# EAGLE design rgb-daughter (EAGLE 8.3.2)

## Sheet 1 of 2
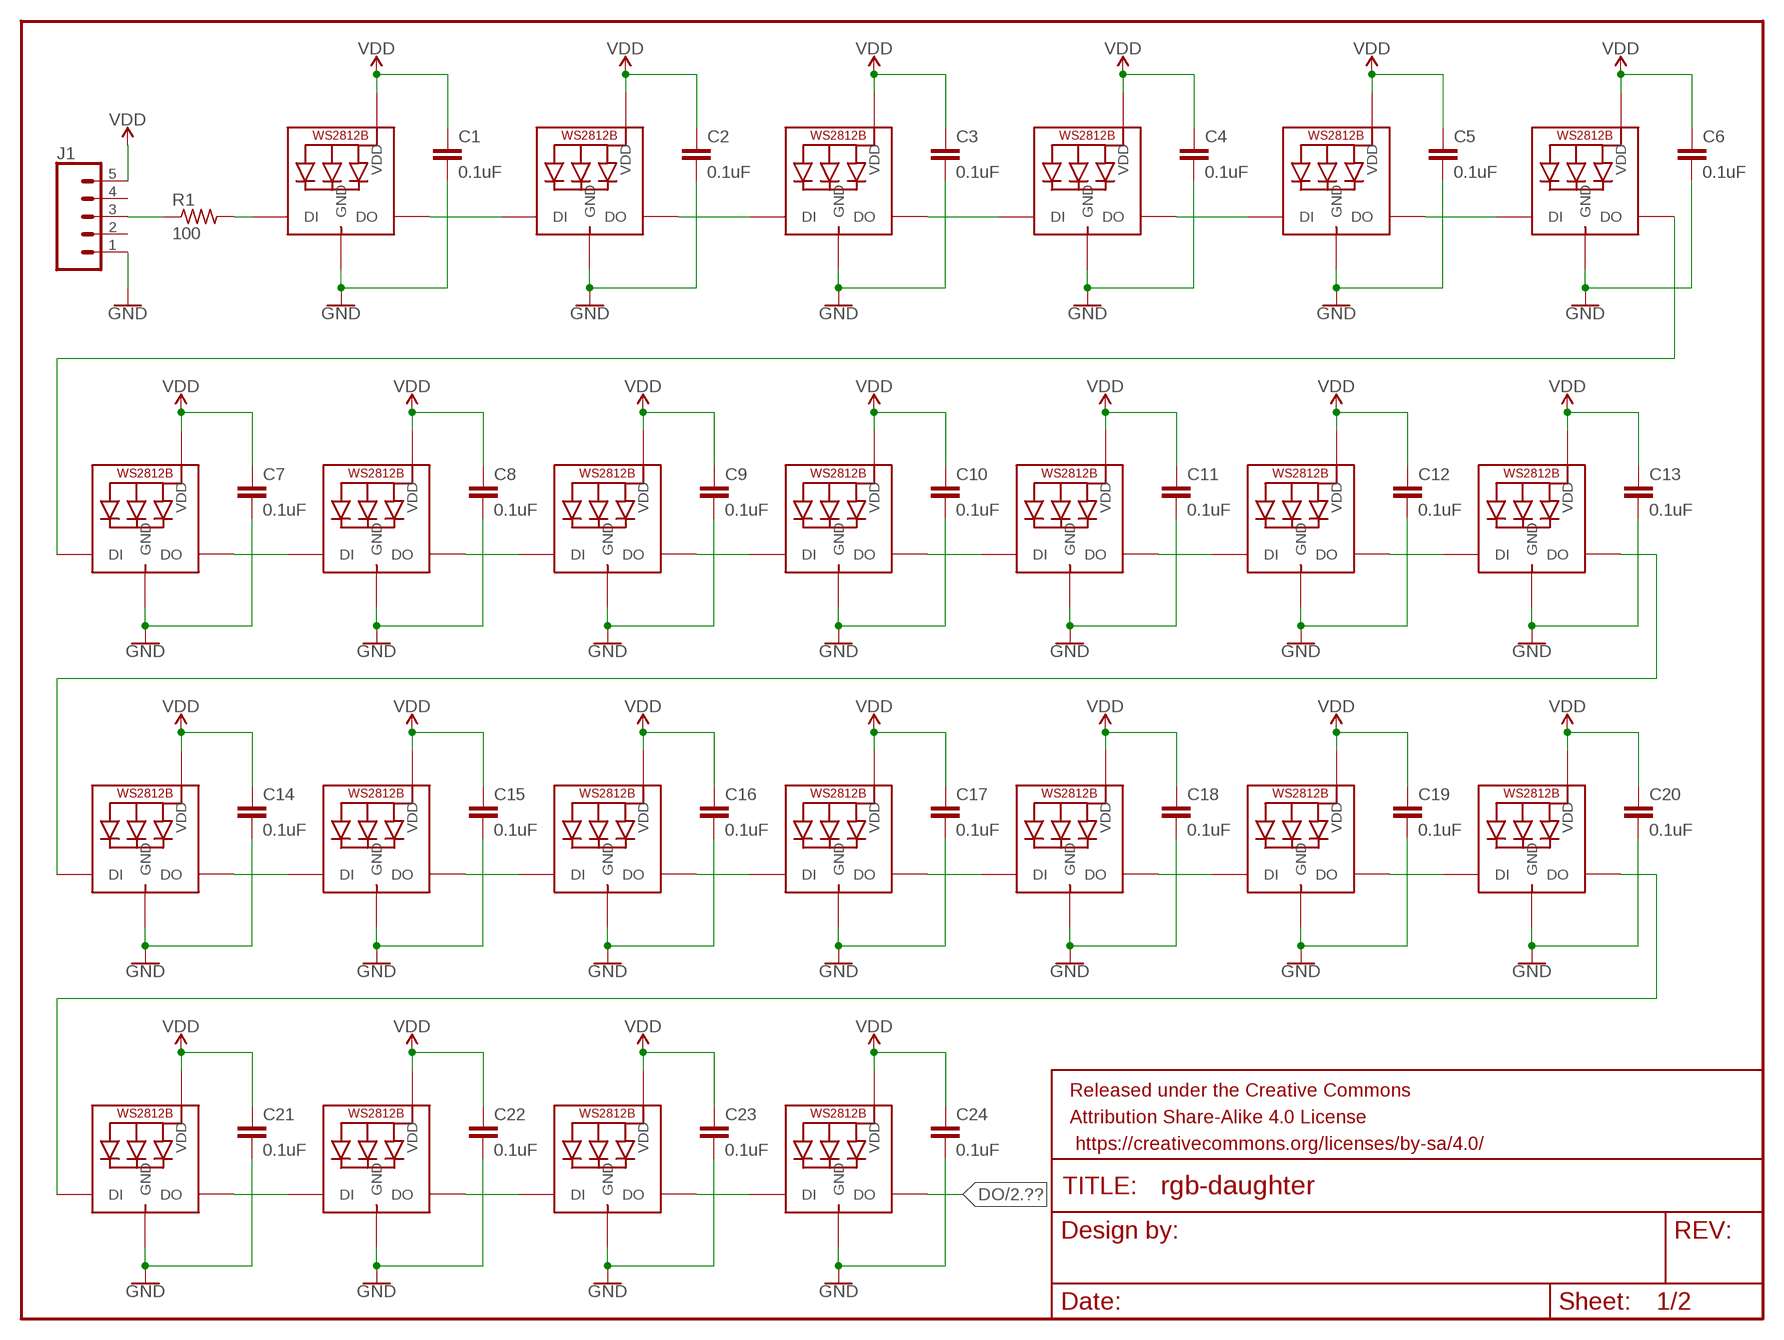
[diagram p0: schematic, sheet 1]

### Parts
C1  0.1uF  0.1UF-0603-25V-(+80/-20%)  [0603]
C2  0.1uF  0.1UF-0603-25V-(+80/-20%)  [0603]
C3  0.1uF  0.1UF-0603-25V-(+80/-20%)  [0603]
C4  0.1uF  0.1UF-0603-25V-(+80/-20%)  [0603]
C5  0.1uF  0.1UF-0603-25V-(+80/-20%)  [0603]
C6  0.1uF  0.1UF-0603-25V-(+80/-20%)  [0603]
C7  0.1uF  0.1UF-0603-25V-(+80/-20%)  [0603]
C8  0.1uF  0.1UF-0603-25V-(+80/-20%)  [0603]
C9  0.1uF  0.1UF-0603-25V-(+80/-20%)  [0603]
C10  0.1uF  0.1UF-0603-25V-(+80/-20%)  [0603]
C11  0.1uF  0.1UF-0603-25V-(+80/-20%)  [0603]
C12  0.1uF  0.1UF-0603-25V-(+80/-20%)  [0603]
C13  0.1uF  0.1UF-0603-25V-(+80/-20%)  [0603]
C14  0.1uF  0.1UF-0603-25V-(+80/-20%)  [0603]
C15  0.1uF  0.1UF-0603-25V-(+80/-20%)  [0603]
C16  0.1uF  0.1UF-0603-25V-(+80/-20%)  [0603]
C17  0.1uF  0.1UF-0603-25V-(+80/-20%)  [0603]
C18  0.1uF  0.1UF-0603-25V-(+80/-20%)  [0603]
C19  0.1uF  0.1UF-0603-25V-(+80/-20%)  [0603]
C20  0.1uF  0.1UF-0603-25V-(+80/-20%)  [0603]
C21  0.1uF  0.1UF-0603-25V-(+80/-20%)  [0603]
C22  0.1uF  0.1UF-0603-25V-(+80/-20%)  [0603]
C23  0.1uF  0.1UF-0603-25V-(+80/-20%)  [0603]
C24  0.1uF  0.1UF-0603-25V-(+80/-20%)  [0603]
FRAME1  FRAME-LETTER  [CREATIVE_COMMONS]
J1  CONN_051.27MM  [1X05_1.27MM]
LED1  WS2812B3535  [LED3535]
LED2  WS2812B3535  [LED3535]
LED3  WS2812B3535  [LED3535]
LED4  WS2812B3535  [LED3535]
LED5  WS2812B3535  [LED3535]
LED6  WS2812B3535  [LED3535]
LED7  WS2812B3535  [LED3535]
LED8  WS2812B3535  [LED3535]
LED9  WS2812B3535  [LED3535]
LED10  WS2812B3535  [LED3535]
LED11  WS2812B3535  [LED3535]
LED12  WS2812B3535  [LED3535]
LED13  WS2812B3535  [LED3535]
LED14  WS2812B3535  [LED3535]
LED15  WS2812B3535  [LED3535]
LED16  WS2812B3535  [LED3535]
LED17  WS2812B3535  [LED3535]
LED18  WS2812B3535  [LED3535]
LED19  WS2812B3535  [LED3535]
LED20  WS2812B3535  [LED3535]
LED21  WS2812B3535  [LED3535]
LED22  WS2812B3535  [LED3535]
LED23  WS2812B3535  [LED3535]
LED48  WS2812B3535  [LED3535]
R1  100  R-US_M0805  [M0805]

### Nets
DO: LED48.3(DO) ; also sheet 2
GND: C1.2 C2.2 C3.2 C4.2 C5.2 C6.2 C7.2 C8.2 C9.2 C10.2 C11.2 C12.2 C13.2 C14.2 C15.2 C16.2 C17.2 C18.2 C19.2 C20.2 C21.2 C22.2 C23.2 C24.2 J1.1 LED1.4(GND) LED2.4(GND) LED3.4(GND) LED4.4(GND) LED5.4(GND) LED6.4(GND) LED7.4(GND) LED8.4(GND) LED9.4(GND) LED10.4(GND) LED11.4(GND) LED12.4(GND) LED13.4(GND) LED14.4(GND) LED15.4(GND) LED16.4(GND) LED17.4(GND) LED18.4(GND) LED19.4(GND) LED20.4(GND) LED21.4(GND) LED22.4(GND) LED23.4(GND) LED48.4(GND) ; also sheet 2
N$1: LED1.1(DI) R1.2
N$2: LED1.3(DO) LED2.1(DI)
N$3: J1.3 R1.1
N$4: LED2.3(DO) LED3.1(DI)
N$5: LED3.3(DO) LED4.1(DI)
N$6: LED4.3(DO) LED5.1(DI)
N$7: LED5.3(DO) LED6.1(DI)
N$8: LED7.3(DO) LED8.1(DI)
N$9: LED8.3(DO) LED9.1(DI)
N$10: LED9.3(DO) LED10.1(DI)
N$11: LED10.3(DO) LED11.1(DI)
N$12: LED11.3(DO) LED12.1(DI)
N$13: LED12.3(DO) LED13.1(DI)
N$14: LED13.3(DO) LED14.1(DI)
N$15: LED14.3(DO) LED15.1(DI)
N$16: LED15.3(DO) LED16.1(DI)
N$17: LED16.3(DO) LED17.1(DI)
N$18: LED17.3(DO) LED18.1(DI)
N$19: LED18.3(DO) LED19.1(DI)
N$20: LED19.3(DO) LED20.1(DI)
N$21: LED20.3(DO) LED21.1(DI)
N$23: LED21.3(DO) LED22.1(DI)
N$24: LED22.3(DO) LED23.1(DI)
N$25: LED23.3(DO) LED48.1(DI)
N$48: LED6.3(DO) LED7.1(DI)
VDD: C1.1 C2.1 C3.1 C4.1 C5.1 C6.1 C7.1 C8.1 C9.1 C10.1 C11.1 C12.1 C13.1 C14.1 C15.1 C16.1 C17.1 C18.1 C19.1 C20.1 C21.1 C22.1 C23.1 C24.1 J1.5 LED1.2(VDD) LED2.2(VDD) LED3.2(VDD) LED4.2(VDD) LED5.2(VDD) LED6.2(VDD) LED7.2(VDD) LED8.2(VDD) LED9.2(VDD) LED10.2(VDD) LED11.2(VDD) LED12.2(VDD) LED13.2(VDD) LED14.2(VDD) LED15.2(VDD) LED16.2(VDD) LED17.2(VDD) LED18.2(VDD) LED19.2(VDD) LED20.2(VDD) LED21.2(VDD) LED22.2(VDD) LED23.2(VDD) LED48.2(VDD) ; also sheet 2
Unconnected: J1.2 J1.4

## Sheet 2 of 2
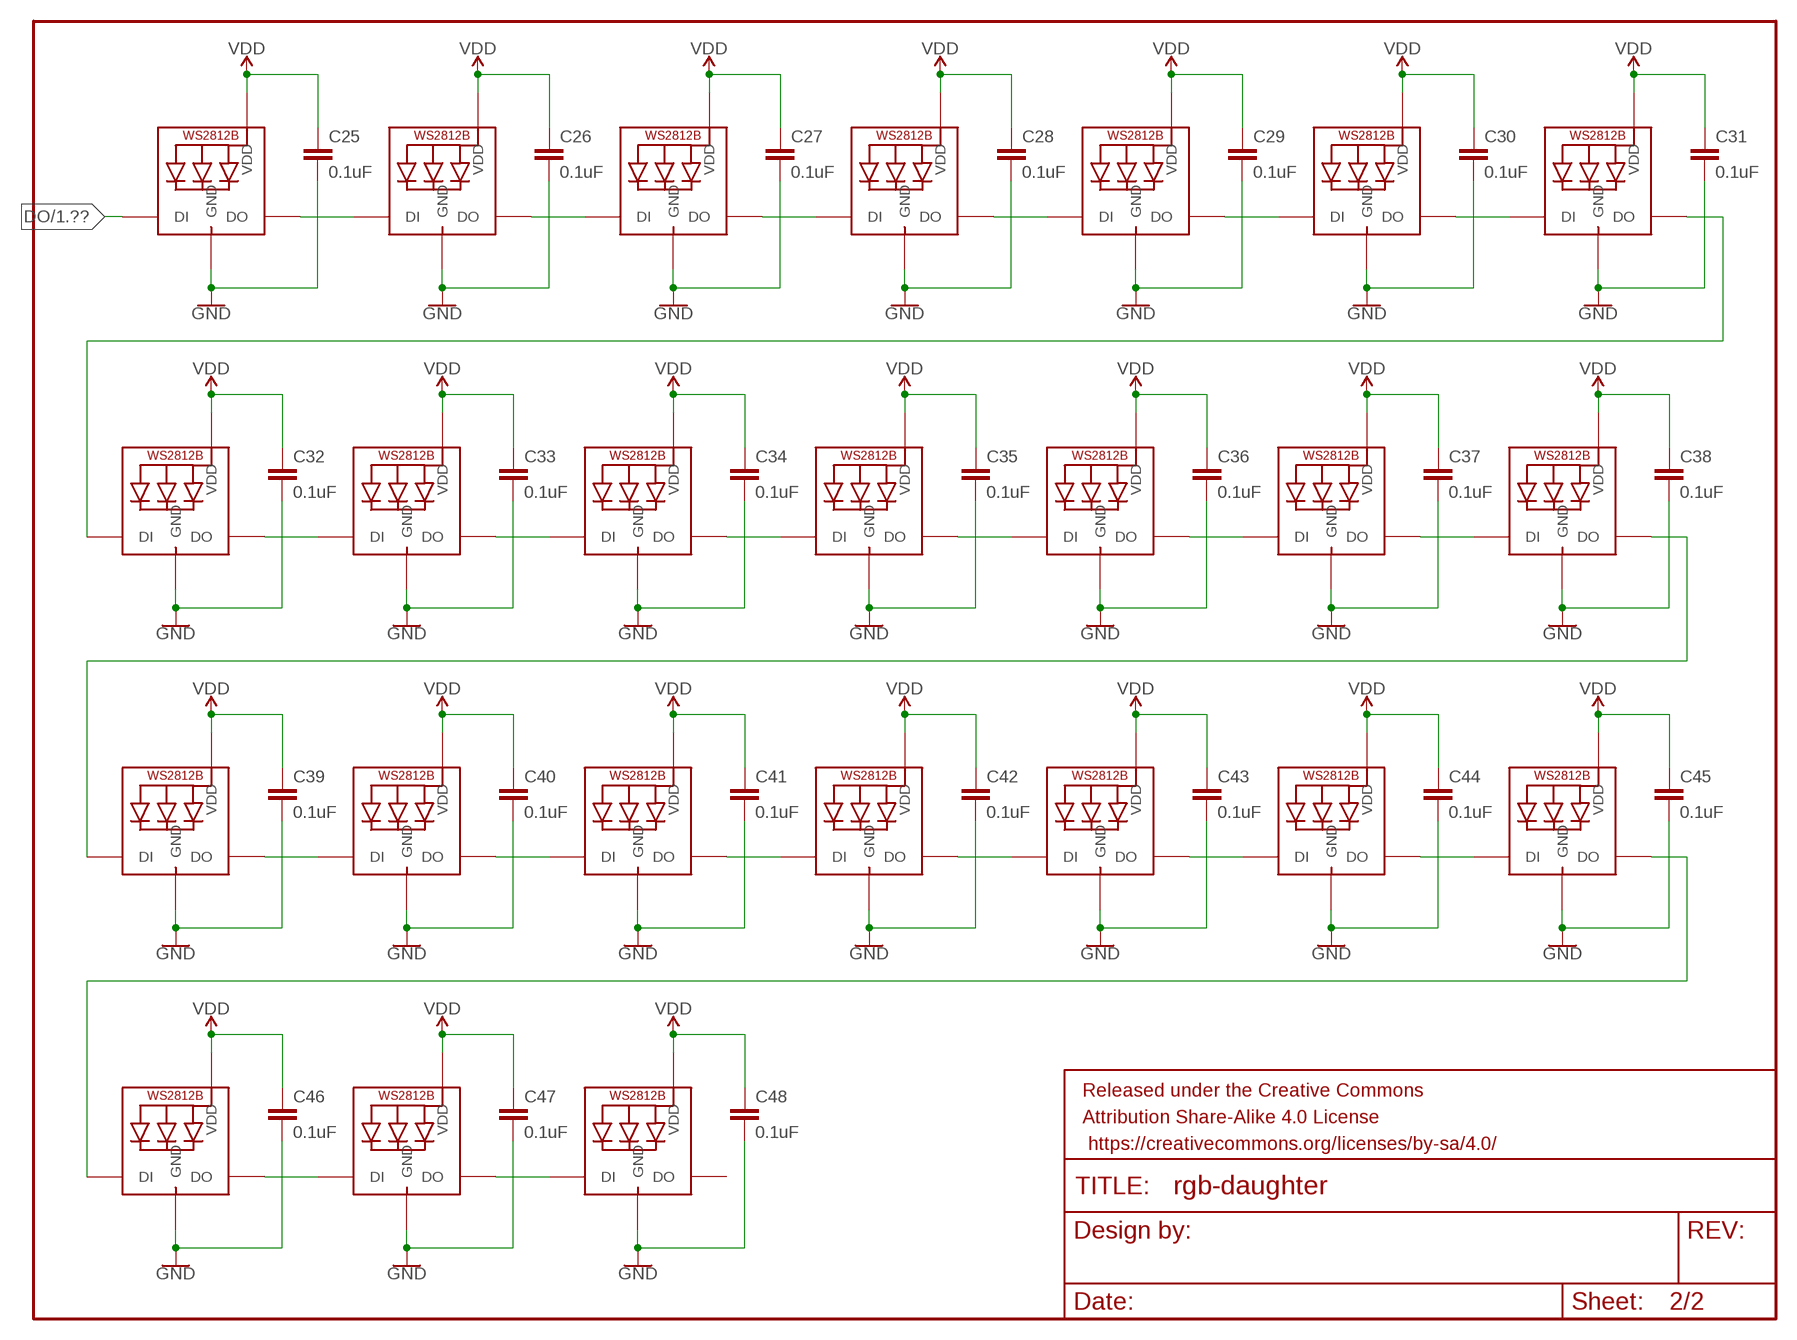
[diagram p1: schematic, sheet 2]

### Parts
C25  0.1uF  0.1UF-0603-25V-(+80/-20%)  [0603]
C26  0.1uF  0.1UF-0603-25V-(+80/-20%)  [0603]
C27  0.1uF  0.1UF-0603-25V-(+80/-20%)  [0603]
C28  0.1uF  0.1UF-0603-25V-(+80/-20%)  [0603]
C29  0.1uF  0.1UF-0603-25V-(+80/-20%)  [0603]
C30  0.1uF  0.1UF-0603-25V-(+80/-20%)  [0603]
C31  0.1uF  0.1UF-0603-25V-(+80/-20%)  [0603]
C32  0.1uF  0.1UF-0603-25V-(+80/-20%)  [0603]
C33  0.1uF  0.1UF-0603-25V-(+80/-20%)  [0603]
C34  0.1uF  0.1UF-0603-25V-(+80/-20%)  [0603]
C35  0.1uF  0.1UF-0603-25V-(+80/-20%)  [0603]
C36  0.1uF  0.1UF-0603-25V-(+80/-20%)  [0603]
C37  0.1uF  0.1UF-0603-25V-(+80/-20%)  [0603]
C38  0.1uF  0.1UF-0603-25V-(+80/-20%)  [0603]
C39  0.1uF  0.1UF-0603-25V-(+80/-20%)  [0603]
C40  0.1uF  0.1UF-0603-25V-(+80/-20%)  [0603]
C41  0.1uF  0.1UF-0603-25V-(+80/-20%)  [0603]
C42  0.1uF  0.1UF-0603-25V-(+80/-20%)  [0603]
C43  0.1uF  0.1UF-0603-25V-(+80/-20%)  [0603]
C44  0.1uF  0.1UF-0603-25V-(+80/-20%)  [0603]
C45  0.1uF  0.1UF-0603-25V-(+80/-20%)  [0603]
C46  0.1uF  0.1UF-0603-25V-(+80/-20%)  [0603]
C47  0.1uF  0.1UF-0603-25V-(+80/-20%)  [0603]
C48  0.1uF  0.1UF-0603-25V-(+80/-20%)  [0603]
FRAME2  FRAME-LETTER  [CREATIVE_COMMONS]
LED24  WS2812B3535  [LED3535]
LED25  WS2812B3535  [LED3535]
LED26  WS2812B3535  [LED3535]
LED27  WS2812B3535  [LED3535]
LED28  WS2812B3535  [LED3535]
LED29  WS2812B3535  [LED3535]
LED30  WS2812B3535  [LED3535]
LED31  WS2812B3535  [LED3535]
LED32  WS2812B3535  [LED3535]
LED33  WS2812B3535  [LED3535]
LED34  WS2812B3535  [LED3535]
LED35  WS2812B3535  [LED3535]
LED36  WS2812B3535  [LED3535]
LED37  WS2812B3535  [LED3535]
LED38  WS2812B3535  [LED3535]
LED39  WS2812B3535  [LED3535]
LED40  WS2812B3535  [LED3535]
LED41  WS2812B3535  [LED3535]
LED42  WS2812B3535  [LED3535]
LED43  WS2812B3535  [LED3535]
LED44  WS2812B3535  [LED3535]
LED45  WS2812B3535  [LED3535]
LED46  WS2812B3535  [LED3535]
LED47  WS2812B3535  [LED3535]

### Nets
DO: LED24.1(DI) ; also sheet 1
GND: C25.2 C26.2 C27.2 C28.2 C29.2 C30.2 C31.2 C32.2 C33.2 C34.2 C35.2 C36.2 C37.2 C38.2 C39.2 C40.2 C41.2 C42.2 C43.2 C44.2 C45.2 C46.2 C47.2 C48.2 LED24.4(GND) LED25.4(GND) LED26.4(GND) LED27.4(GND) LED28.4(GND) LED29.4(GND) LED30.4(GND) LED31.4(GND) LED32.4(GND) LED33.4(GND) LED34.4(GND) LED35.4(GND) LED36.4(GND) LED37.4(GND) LED38.4(GND) LED39.4(GND) LED40.4(GND) LED41.4(GND) LED42.4(GND) LED43.4(GND) LED44.4(GND) LED45.4(GND) LED46.4(GND) LED47.4(GND) ; also sheet 1
N$22: LED24.3(DO) LED25.1(DI)
N$26: LED25.3(DO) LED26.1(DI)
N$27: LED26.3(DO) LED27.1(DI)
N$28: LED27.3(DO) LED28.1(DI)
N$29: LED28.3(DO) LED29.1(DI)
N$30: LED29.3(DO) LED30.1(DI)
N$31: LED30.3(DO) LED31.1(DI)
N$32: LED31.3(DO) LED32.1(DI)
N$33: LED32.3(DO) LED33.1(DI)
N$34: LED33.3(DO) LED34.1(DI)
N$35: LED34.3(DO) LED35.1(DI)
N$36: LED35.3(DO) LED36.1(DI)
N$37: LED36.3(DO) LED37.1(DI)
N$38: LED37.3(DO) LED38.1(DI)
N$39: LED38.3(DO) LED39.1(DI)
N$40: LED39.3(DO) LED40.1(DI)
N$41: LED40.3(DO) LED41.1(DI)
N$42: LED41.3(DO) LED42.1(DI)
N$43: LED42.3(DO) LED43.1(DI)
N$44: LED43.3(DO) LED44.1(DI)
N$45: LED44.3(DO) LED45.1(DI)
N$46: LED45.3(DO) LED46.1(DI)
N$47: LED46.3(DO) LED47.1(DI)
VDD: C25.1 C26.1 C27.1 C28.1 C29.1 C30.1 C31.1 C32.1 C33.1 C34.1 C35.1 C36.1 C37.1 C38.1 C39.1 C40.1 C41.1 C42.1 C43.1 C44.1 C45.1 C46.1 C47.1 C48.1 LED24.2(VDD) LED25.2(VDD) LED26.2(VDD) LED27.2(VDD) LED28.2(VDD) LED29.2(VDD) LED30.2(VDD) LED31.2(VDD) LED32.2(VDD) LED33.2(VDD) LED34.2(VDD) LED35.2(VDD) LED36.2(VDD) LED37.2(VDD) LED38.2(VDD) LED39.2(VDD) LED40.2(VDD) LED41.2(VDD) LED42.2(VDD) LED43.2(VDD) LED44.2(VDD) LED45.2(VDD) LED46.2(VDD) LED47.2(VDD) ; also sheet 1
Unconnected: LED47.3(DO)

## Library data of the parts
C1-C48 = SparkFun-Capacitors:0.1UF: 0.1µF ceramic capacitors A capacitor is a passive two-terminal electrical component used to store electrical energy temporarily in an electric field.; PROD_ID: CAP-00810
FRAME1 FRAME2 = SparkFun-Aesthetics:FRAME-LETTER: Schematic Frame - Letter Standard 8.5x11 US Letter frame
J1 = SparkFun-Connectors:CONN_05: Multi connection point. Often used as Generic Header-pin footprint for 0.1 inch spaced/style header connections On any of the 0.1 inch spaced packages, you can populate with these: Break Away Headers - Straight <https://www.sparkfun.com/products/116> (PRT-00116) Break Away Male Headers - Right Angle <https://www.sparkfun.com/products/553> (PRT-00553) Female Headers <https://www.sparkfun.com/products/115> (PRT-00115) Break Away Headers - Machine Pin <https://www.sparkfun.com/products/117> (PRT-00117) Break Away Female Headers - Swiss Machine Pin <https://www.sparkfun.com/products/743> (PRT-00743) For SCREWTERMINALS and SPRING TERMINALS visit here: Screw Terimnals on SparkFun.com <https://www.sparkfun.com/search/results?term=Screw+Terminals> (5mm/3.5mm/2.54mm spacing) This device is also useful as a general connection point to wire up your design to another part of your project. Our various solder wires solder well into these plated through hole pads. Hook-Up Wire - Assortment (Stranded, 22 AWG) <https://www.sparkfun.com/products/11375> (PRT-11375) Hook-Up Wire - Assortment (Solid Core, 22 AWG) <https://www.sparkfun.com/products/11367> (PRT-11367) View the entire wire category on our website here <https://www.sparkfun.com/categories/141> Special notes: Molex polarized connector foot print use with SKU : PRT-08231 with associated crimp pins and housings. 1MM SMD Version SKU: PRT-10208
LED1-LED48 = adafruit:WS2812B
R1 = resistor:R-US_: RESISTOR, American symbol

## Board
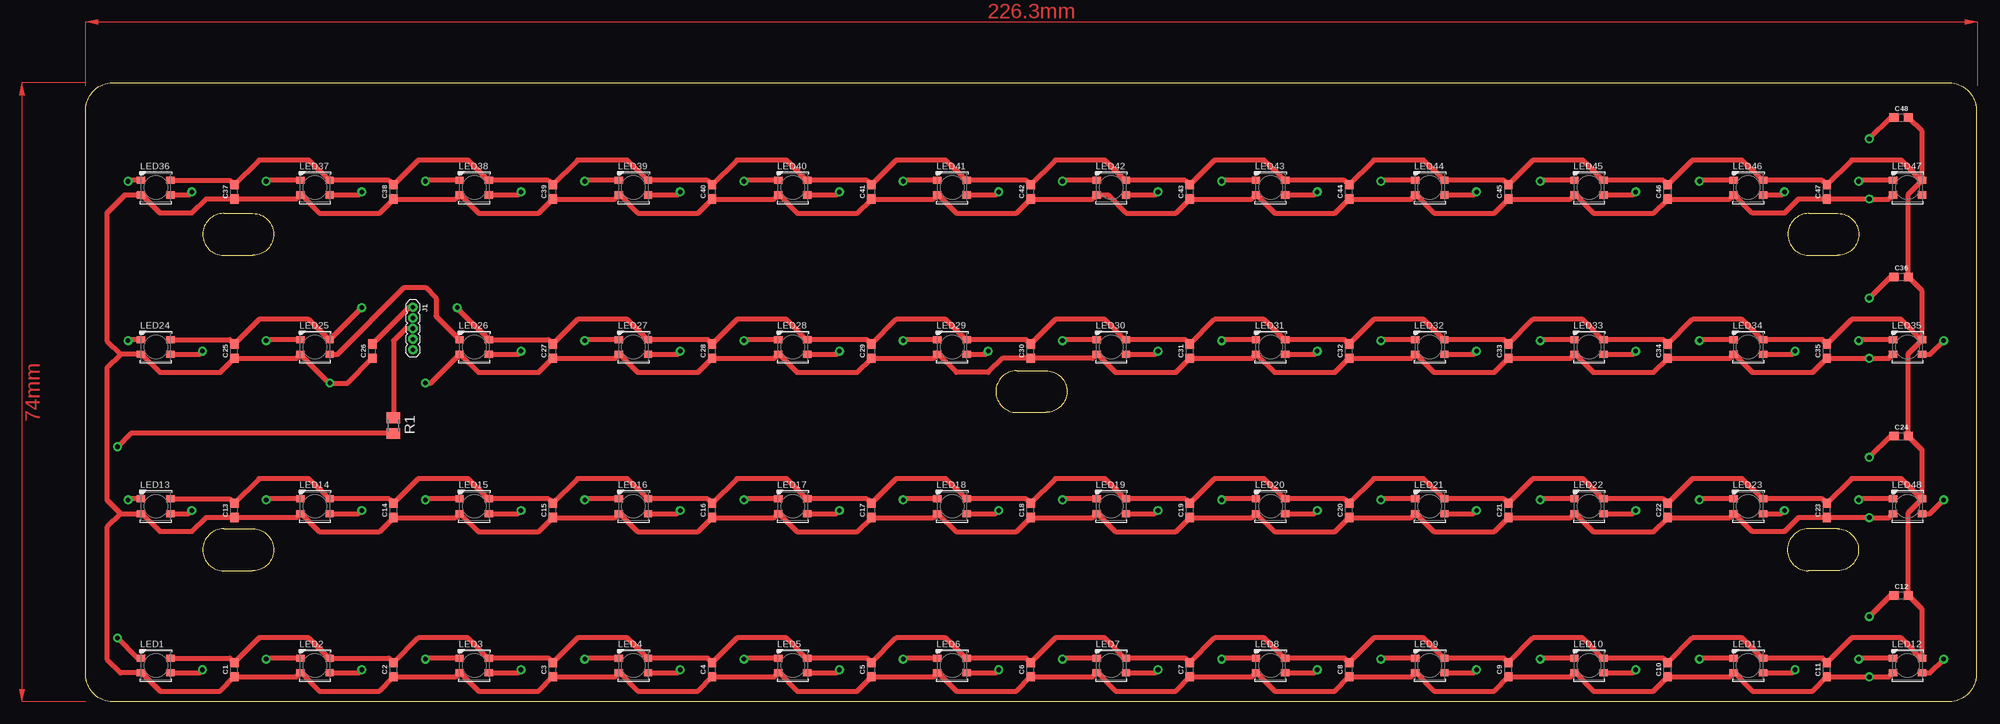
[diagram p2: board, top side]
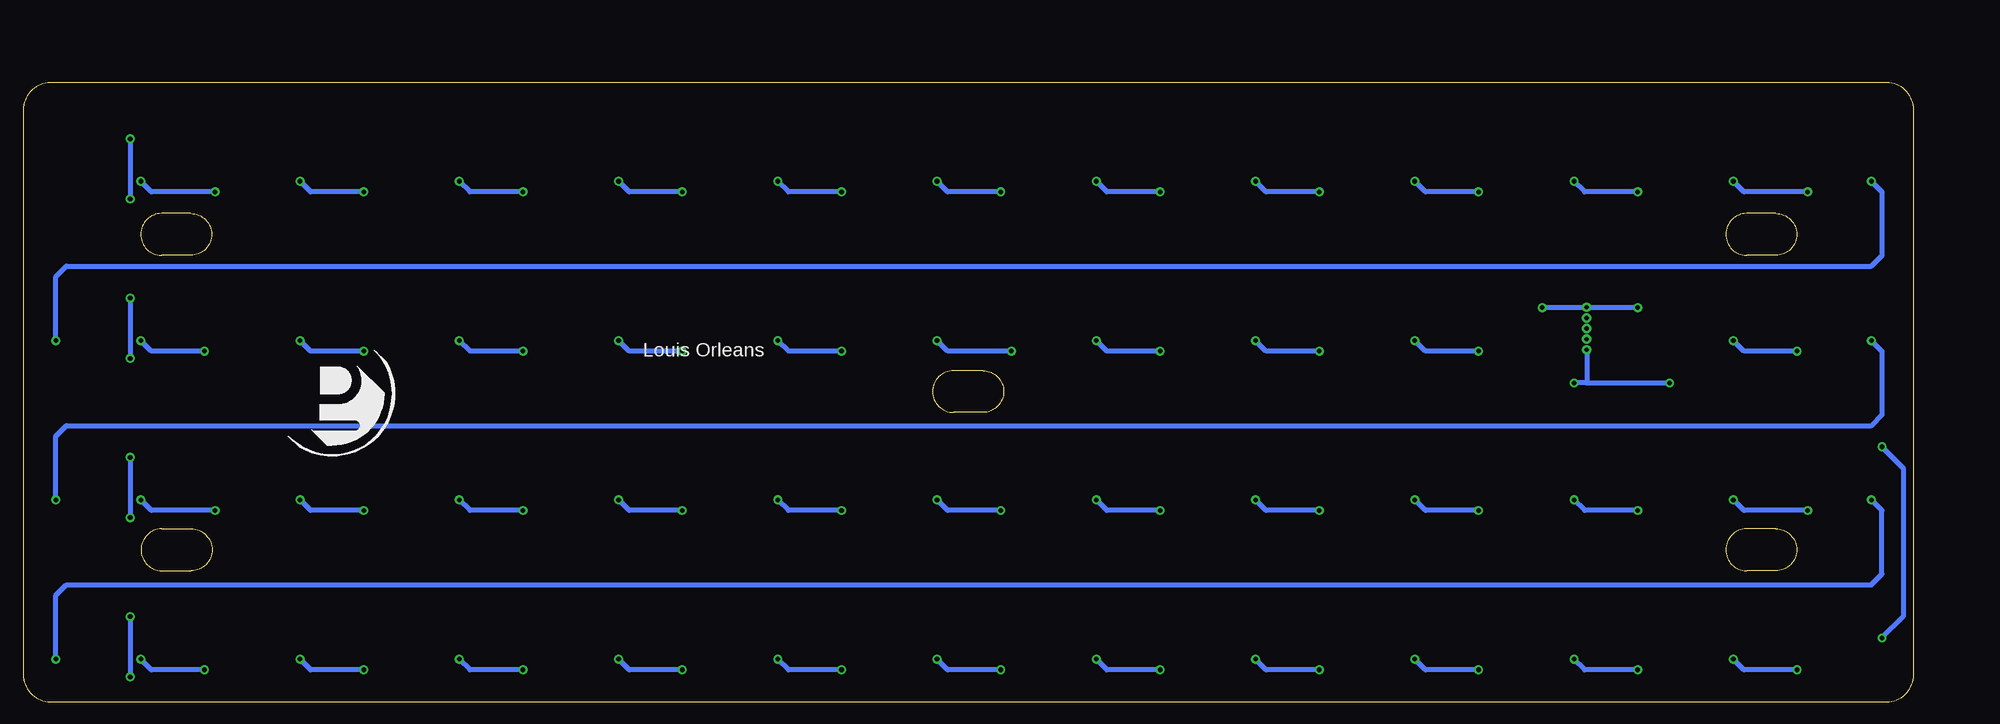
[diagram p3: board, bottom side, seen from below]

Size 226.14 x 74 mm. Coordinates in mm from the lower left corner, seen from the top.
Outline: 222.91,0 3.23,0 arc-90 0,3.23 0,70.78 arc-90 3.23,74 222.91,74 arc-90 226.14,70.78 226.14,3.23 arc-90 222.91,0
Outline: 16.5,58.38 arc180 16.5,53.38 20,53.38 arc180 20,58.38 16.5,58.38
Outline: 16.5,20.66 arc180 16.5,15.66 20,15.66 arc180 20,20.66 16.5,20.66
Outline: 209.56,20.66 arc-180 209.56,15.66 206.06,15.66 arc-180 206.06,20.66 209.56,20.66
Outline: 206.11,58.38 arc180 206.11,53.38 209.61,53.38 arc180 209.61,58.38 206.11,58.38
Outline: 111.37,39.58 arc180 111.37,34.58 114.87,34.58 arc180 114.87,39.58 111.37,39.58
Copper layers (1*16): Top 0.035mm / dielectric 1.5mm / Bottom 0.035mm
Design rules "SparkFun": minimum track width 8mil, minimum drill 20mil, track to track 8mil, track to pad 8mil, pad to pad 8mil, via to via 8mil, smd to smd 8mil, copper to edge 8mil, drill to drill 8mil, minimum pad ring 12mil, minimum via ring 10mil, stop-mask expansion 4mil, vias tented up to drill 20mil, thermal gap 10mil

### Footprints (pad centres in the part's own frame; a part is rotated, then mirrored left to right if it is on the bottom)
0603 = smd 1.1 x 1: 1 -0.85,0; 2 0.85,0
1X05_1.27MM = drill 0.508 pad 1: 1 0,0; 2 1.27,0; 3 2.54,0; 4 3.81,0; 5 5.08,0
LED3535 = smd 1 x 0.85: 1 -1.75,0.875; 2 -1.75,-0.875; 3 1.75,-0.875; 4 1.75,0.875
M0805 = smd 1.3 x 1.6: 1 -0.95,0; 2 0.95,0

### Placement (x,y rotation side)
C1  17.78,3.81 90 top
C2  36.83,3.81 90 top
C3  55.88,3.81 90 top
C4  74.93,3.81 90 top
C5  93.98,3.81 90 top
C6  113.03,3.81 90 top
C7  132.08,3.81 90 top
C8  151.13,3.81 90 top
C9  170.18,3.81 90 top
C10  189.23,3.81 90 top
C11  208.28,3.81 90 top
C12  217.17,12.7 0 top
C13  17.78,22.86 90 top
C14  36.83,22.86 90 top
C15  55.88,22.86 90 top
C16  74.93,22.86 90 top
C17  93.98,22.86 90 top
C18  113.03,22.86 90 top
C19  132.08,22.86 90 top
C20  151.13,22.86 90 top
C21  170.18,22.86 90 top
C22  189.23,22.86 90 top
C23  208.28,22.86 90 top
C24  217.17,31.75 0 top
C25  17.78,41.91 90 top
C26  34.29,41.91 90 top
C27  55.88,41.91 90 top
C28  74.93,41.91 90 top
C29  93.98,41.91 90 top
C30  113.03,41.91 90 top
C31  132.08,41.91 90 top
C32  151.13,41.91 90 top
C33  170.18,41.91 90 top
C34  189.23,41.91 90 top
C35  208.28,41.91 90 top
C36  217.17,50.8 0 top
C37  17.78,60.96 90 top
C38  36.83,60.96 90 top
C39  55.88,60.96 90 top
C40  74.93,60.96 90 top
C41  93.98,60.96 90 top
C42  113.03,60.96 90 top
C43  132.08,60.96 90 top
C44  151.13,60.96 90 top
C45  170.18,60.96 90 top
C46  189.23,60.96 90 top
C47  208.28,60.96 90 top
C48  217.17,69.85 0 top
FRAME1  178.69,41.27 0 bottom
FRAME2  157.48,-19.05 0 top  (outside the outline)
J1  39.14,47.16 270 top
LED1  8.38,4.32 0 top
LED2  27.43,4.32 0 top
LED3  46.48,4.32 0 top
LED4  65.53,4.32 0 top
LED5  84.58,4.32 0 top
LED6  103.63,4.32 0 top
LED7  122.68,4.32 0 top
LED8  141.73,4.32 0 top
LED9  160.78,4.32 0 top
LED10  179.83,4.32 0 top
LED11  198.88,4.32 0 top
LED12  217.93,4.32 0 top
LED13  8.38,23.37 0 top
LED14  27.43,23.37 0 top
LED15  46.48,23.37 0 top
LED16  65.53,23.37 0 top
LED17  84.58,23.37 0 top
LED18  103.63,23.37 0 top
LED19  122.68,23.37 0 top
LED20  141.73,23.37 0 top
LED21  160.78,23.37 0 top
LED22  179.83,23.37 0 top
LED23  198.88,23.37 0 top
LED24  8.38,42.42 0 top
LED25  27.43,42.42 0 top
LED26  46.48,42.42 0 top
LED27  65.53,42.42 0 top
LED28  84.58,42.42 0 top
LED29  103.63,42.42 0 top
LED30  122.68,42.42 0 top
LED31  141.73,42.42 0 top
LED32  160.78,42.42 0 top
LED33  179.83,42.42 0 top
LED34  198.88,42.42 0 top
LED35  217.93,42.42 0 top
LED36  8.38,61.47 0 top
LED37  27.43,61.47 0 top
LED38  46.48,61.47 0 top
LED39  65.53,61.47 0 top
LED40  84.58,61.47 0 top
LED41  103.63,61.47 0 top
LED42  122.68,61.47 0 top
LED43  141.73,61.47 0 top
LED44  160.78,61.47 0 top
LED45  179.83,61.47 0 top
LED46  198.88,61.47 0 top
LED47  217.93,61.47 0 top
LED48  217.93,23.37 0 top
R1  36.83,33.02 270 top

### Tracks (layer width: path | path; a pad name or v marks a point on that pad's centre or on a via)
DO  (via drill 0.55)
  Top 0.61: LED48.3 220.61,22.49 v222.25,24.13 | LED24.1 5.19,43.29 v5.08,43.18
  Bottom 0.61: v222.25,24.13 222.25,31.75 220.98,33.02 5.08,33.02 3.81,34.29 3.81,41.91 v5.08,43.18
GND  (via drill 0.55)
  Top 0.61: v44.45,47.12 44.45,47.08 LED26.4 55.35,43.29 C27.2 58.84,45.72 64.77,45.72 67.2,43.29 LED27.4 74.4,43.29 C28.2 77.89,45.72 83.82,45.72 86.25,43.29 LED28.4 93.45,43.29 C29.2 96.94,45.72 102.87,45.72 105.3,43.29 LED29.4 112.5,43.29 C30.2 115.99,45.72 121.92,45.72 124.35,43.29 LED30.4 131.55,43.29 C31.2 135.04,45.72 140.97,45.72 143.4,43.29 LED31.4 150.6,43.29 C32.2 154.09,45.72 160.02,45.72 162.45,43.29 LED32.4 169.65,43.29 C33.2 173.14,45.72 179.07,45.72 181.5,43.29 LED33.4 188.7,43.29 C34.2 192.19,45.72 198.12,45.72 200.55,43.29 LED34.4 207.75,43.29 C35.2 211.24,45.72 217.17,45.72 219.6,43.29 LED35.4 | v33.02,47.12 33.01,47.12 LED25.4 29.1,43.29 26.67,45.72 20.74,45.72 C25.2 17.25,43.29 LED24.4 | J1.1 38.69,47.16 C26.2 | LED1.4 17.25,5.19 C1.2 20.74,7.62 26.67,7.62 29.1,5.19 LED2.4 36.3,5.19 C2.2 39.79,7.62 45.72,7.62 48.15,5.19 LED3.4 55.35,5.19 C3.2 58.84,7.62 64.77,7.62 67.2,5.19 LED4.4 74.4,5.19 C4.2 77.89,7.62 83.82,7.62 86.25,5.19 LED5.4 93.45,5.19 C5.2 96.94,7.62 102.87,7.62 105.3,5.19 LED6.4 112.5,5.19 C6.2 115.99,7.62 121.92,7.62 124.35,5.19 LED7.4 131.55,5.19 C7.2 135.04,7.62 140.97,7.62 143.4,5.19 LED8.4 150.6,5.19 C8.2 154.09,7.62 160.02,7.62 162.45,5.19 LED9.4 169.65,5.19 C9.2 173.14,7.62 179.07,7.62 181.5,5.19 LED10.4 188.7,5.19 C10.2 192.19,7.62 198.12,7.62 200.55,5.19 LED11.4 207.75,5.19 C11.2 211.24,7.62 217.17,7.62 219.6,5.19 LED12.4 219.68,11.04 C12.2 218.02,22.58 LED48.4 | LED48.4 219.6,24.24 217.17,26.67 211.24,26.67 C23.2 207.75,24.24 LED23.4 200.55,24.24 198.12,26.67 192.19,26.67 C22.2 188.7,24.24 LED22.4 181.5,24.24 179.07,26.67 173.14,26.67 C21.2 169.65,24.24 LED21.4 162.45,24.24 160.02,26.67 154.09,26.67 C20.2 150.6,24.24 LED20.4 143.4,24.24 140.97,26.67 135.04,26.67 C19.2 131.55,24.24 LED19.4 124.35,24.24 121.92,26.67 115.99,26.67 C18.2 112.5,24.24 LED18.4 105.3,24.24 102.87,26.67 96.94,26.67 C17.2 93.45,24.24 LED17.4 86.25,24.24 83.82,26.67 77.89,26.67 C16.2 74.4,24.24 LED16.4 67.2,24.24 64.77,26.67 58.84,26.67 C15.2 55.35,24.24 LED15.4 48.15,24.24 45.72,26.67 39.79,26.67 C14.2 36.3,24.24 LED14.4 29.1,24.24 26.67,26.67 20.74,26.67 C13.2 17.25,24.24 LED13.4
  Top 0.61: LED47.4 219.6,62.34 217.17,64.77 211.24,64.77 C47.2 207.75,62.34 LED46.4 200.55,62.34 198.12,64.77 192.19,64.77 C46.2 188.7,62.34 LED45.4 181.5,62.34 179.07,64.77 173.14,64.77 C45.2 169.65,62.34 LED44.4 162.45,62.34 160.02,64.77 154.09,64.77 C44.2 150.6,62.34 LED43.4 143.4,62.34 140.97,64.77 135.04,64.77 C43.2 131.55,62.34 LED42.4 124.35,62.34 121.92,64.77 115.99,64.77 C42.2 112.5,62.34 LED41.4 105.3,62.34 102.87,64.77 96.94,64.77 C41.2 93.45,62.34 LED40.4 86.25,62.34 83.82,64.77 77.89,64.77 C40.2 74.4,62.34 LED39.4 67.2,62.34 64.77,64.77 58.84,64.77 C39.2 55.35,62.34 LED38.4 48.15,62.34 45.72,64.77 39.79,64.77 C38.2 36.3,62.34 LED37.4 29.1,62.34 26.67,64.77 20.74,64.77 C37.2 17.25,62.34 LED36.4 | LED47.4 219.68,68.19 C48.2 | LED35.4 219.68,49.14 C36.2 218.02,60.68 LED47.4 | LED48.4 219.68,30.09 C24.2 218.02,41.63 LED35.4
  Bottom 0.61: v44.45,47.12 44.41,47.16 J1.1 33.06,47.16 v33.02,47.12
N$1  (via drill 0.55)
  Top 0.61: R1.2 5.4,32.07 v3.81,30.48 | LED1.1 6.24,5.19 v3.81,7.62
  Bottom 0.61: v3.81,30.48 1.27,27.94 1.27,10.16 v3.81,7.62
N$2  (via drill 0.55)
  Top 0.61: LED1.3 13.6,3.44 v13.97,3.81 | LED2.1 21.7,5.19 v21.59,5.08
  Bottom 0.61: v13.97,3.81 20.32,3.81 v21.59,5.08
N$3
  Top 0.61: J1.3 38.27,44.62 36.83,43.18 R1.1
N$4  (via drill 0.55)
  Top 0.61: LED2.3 32.65,3.44 v33.02,3.81 | LED3.1 40.75,5.19 v40.64,5.08
  Bottom 0.61: v33.02,3.81 39.37,3.81 v40.64,5.08
N$5  (via drill 0.55)
  Top 0.61: LED3.3 51.7,3.44 v52.07,3.81 | LED4.1 59.8,5.19 v59.69,5.08
  Bottom 0.61: v52.07,3.81 58.42,3.81 v59.69,5.08
N$6  (via drill 0.55)
  Top 0.61: LED4.3 70.75,3.44 v71.12,3.81 | LED5.1 78.85,5.19 v78.74,5.08
  Bottom 0.61: v71.12,3.81 77.47,3.81 v78.74,5.08
N$7  (via drill 0.55)
  Top 0.61: LED5.3 89.8,3.44 v90.17,3.81 | LED6.1 97.9,5.19 v97.79,5.08
  Bottom 0.61: v90.17,3.81 96.52,3.81 v97.79,5.08
N$8  (via drill 0.55)
  Top 0.61: LED7.3 127.9,3.44 v128.27,3.81 | LED8.1 136,5.19 v135.89,5.08
  Bottom 0.61: v128.27,3.81 134.62,3.81 v135.89,5.08
N$9  (via drill 0.55)
  Top 0.61: LED8.3 146.95,3.44 v147.32,3.81 | LED9.1 155.05,5.19 v154.94,5.08
  Bottom 0.61: v147.32,3.81 153.67,3.81 v154.94,5.08
N$10  (via drill 0.55)
  Top 0.61: LED9.3 166,3.44 v166.37,3.81 | LED10.1 174.1,5.19 v173.99,5.08
  Bottom 0.61: v166.37,3.81 172.72,3.81 v173.99,5.08
N$11  (via drill 0.55)
  Top 0.61: LED10.3 185.05,3.44 v185.42,3.81 | LED11.1 193.15,5.19 v193.04,5.08
  Bottom 0.61: v185.42,3.81 191.77,3.81 v193.04,5.08
N$12  (via drill 0.55)
  Top 0.61: LED11.3 204.1,3.44 v204.47,3.81 | LED12.1 212.2,5.19 v212.09,5.08
  Bottom 0.61: v204.47,3.81 210.82,3.81 v212.09,5.08
N$13  (via drill 0.55)
  Top 0.61: LED12.3 220.61,3.44 v222.25,5.08 | LED13.1 5.19,24.24 v5.08,24.13
  Bottom 0.61: v222.25,5.08 222.25,12.7 220.98,13.97 5.08,13.97 3.81,15.24 3.81,22.86 v5.08,24.13
N$14  (via drill 0.55)
  Top 0.61: LED13.3 12.33,22.49 v12.7,22.86 | LED14.1 21.7,24.24 v21.59,24.13
  Bottom 0.61: v12.7,22.86 20.32,22.86 v21.59,24.13
N$15  (via drill 0.55)
  Top 0.61: LED14.3 32.65,22.49 v33.02,22.86 | LED15.1 40.75,24.24 v40.64,24.13
  Bottom 0.61: v33.02,22.86 39.37,22.86 v40.64,24.13
N$16  (via drill 0.55)
  Top 0.61: LED15.3 51.7,22.49 v52.07,22.86 | LED16.1 59.8,24.24 v59.69,24.13
  Bottom 0.61: v52.07,22.86 58.42,22.86 v59.69,24.13
N$17  (via drill 0.55)
  Top 0.61: LED16.3 70.75,22.49 v71.12,22.86 | LED17.1 78.85,24.24 v78.74,24.13
  Bottom 0.61: v71.12,22.86 77.47,22.86 v78.74,24.13
N$18  (via drill 0.55)
  Top 0.61: LED17.3 89.8,22.49 v90.17,22.86 | LED18.1 97.9,24.24 v97.79,24.13
  Bottom 0.61: v90.17,22.86 96.52,22.86 v97.79,24.13
N$19  (via drill 0.55)
  Top 0.61: LED18.3 108.85,22.49 v109.22,22.86 | LED19.1 116.95,24.24 v116.84,24.13
  Bottom 0.61: v109.22,22.86 115.57,22.86 v116.84,24.13
N$20  (via drill 0.55)
  Top 0.61: LED19.3 127.9,22.49 v128.27,22.86 | LED20.1 136,24.24 v135.89,24.13
  Bottom 0.61: v128.27,22.86 134.62,22.86 v135.89,24.13
N$21  (via drill 0.55)
  Top 0.61: LED20.3 146.95,22.49 v147.32,22.86 | LED21.1 155.05,24.24 v154.94,24.13
  Bottom 0.61: v147.32,22.86 153.67,22.86 v154.94,24.13
N$22  (via drill 0.55)
  Top 0.61: LED24.3 13.6,41.54 v13.97,41.91 | LED25.1 21.7,43.29 v21.59,43.18
  Bottom 0.61: v13.97,41.91 20.32,41.91 v21.59,43.18
N$23  (via drill 0.55)
  Top 0.61: LED21.3 166,22.49 v166.37,22.86 | LED22.1 174.1,24.24 v173.99,24.13
  Bottom 0.61: v166.37,22.86 172.72,22.86 v173.99,24.13
N$24  (via drill 0.55)
  Top 0.61: LED22.3 185.05,22.49 v185.42,22.86 | LED23.1 193.15,24.24 v193.04,24.13
  Bottom 0.61: v185.42,22.86 191.77,22.86 v193.04,24.13
N$25  (via drill 0.55)
  Top 0.61: LED23.3 202.83,22.49 v203.2,22.86 | LED48.1 212.2,24.24 v212.09,24.13
  Bottom 0.61: v203.2,22.86 210.82,22.86 v212.09,24.13
N$26
  Top 0.61: LED25.3 30.11,41.54 38.1,49.53 40.64,49.53 41.91,48.26 41.91,46.12 LED26.1
N$27  (via drill 0.55)
  Top 0.61: LED26.3 51.7,41.54 v52.07,41.91 | LED27.1 59.8,43.29 v59.69,43.18
  Bottom 0.61: v52.07,41.91 58.42,41.91 v59.69,43.18
N$28  (via drill 0.55)
  Top 0.61: LED27.3 70.75,41.54 v71.12,41.91 | LED28.1 78.85,43.29 v78.74,43.18
  Bottom 0.61: v71.12,41.91 77.47,41.91 v78.74,43.18
N$29  (via drill 0.55)
  Top 0.61: LED28.3 89.8,41.54 v90.17,41.91 | LED29.1 97.9,43.29 v97.79,43.18
  Bottom 0.61: v90.17,41.91 96.52,41.91 v97.79,43.18
N$30  (via drill 0.55)
  Top 0.61: LED29.3 107.58,41.54 v107.95,41.91 | LED30.1 116.95,43.29 v116.84,43.18
  Bottom 0.61: v107.95,41.91 115.57,41.91 v116.84,43.18
N$31  (via drill 0.55)
  Top 0.61: LED30.3 127.9,41.54 v128.27,41.91 | LED31.1 136,43.29 v135.89,43.18
  Bottom 0.61: v128.27,41.91 134.62,41.91 v135.89,43.18
N$32  (via drill 0.55)
  Top 0.61: LED31.3 146.95,41.54 v147.32,41.91 | LED32.1 155.05,43.29 v154.94,43.18
  Bottom 0.61: v147.32,41.91 153.67,41.91 v154.94,43.18
N$33  (via drill 0.55)
  Top 0.61: LED32.3 166,41.54 v166.37,41.91 | LED33.1 174.1,43.29 v173.99,43.18
  Bottom 0.61: v166.37,41.91 172.72,41.91 v173.99,43.18
N$34  (via drill 0.55)
  Top 0.61: LED33.3 185.05,41.54 v185.42,41.91 | LED34.1 193.15,43.29 v193.04,43.18
  Bottom 0.61: v185.42,41.91 191.77,41.91 v193.04,43.18
N$35  (via drill 0.55)
  Top 0.61: LED34.3 204.1,41.54 v204.47,41.91 | LED35.1 212.2,43.29 v212.09,43.18
  Bottom 0.61: v204.47,41.91 210.82,41.91 v212.09,43.18
N$36  (via drill 0.55)
  Top 0.61: LED35.3 220.61,41.54 v222.25,43.18 | LED36.1 5.19,62.34 v5.08,62.23
  Bottom 0.61: v222.25,43.18 222.25,50.8 220.98,52.07 5.08,52.07 3.81,53.34 3.81,60.96 v5.08,62.23
N$37  (via drill 0.55)
  Top 0.61: LED36.3 12.33,60.59 v12.7,60.96 | LED37.1 21.7,62.34 v21.59,62.23
  Bottom 0.61: v12.7,60.96 20.32,60.96 v21.59,62.23
N$38  (via drill 0.55)
  Top 0.61: LED37.3 32.65,60.59 v33.02,60.96 | LED38.1 40.75,62.34 v40.64,62.23
  Bottom 0.61: v33.02,60.96 39.37,60.96 v40.64,62.23
N$39  (via drill 0.55)
  Top 0.61: LED38.3 51.7,60.59 v52.07,60.96 | LED39.1 59.8,62.34 v59.69,62.23
  Bottom 0.61: v52.07,60.96 58.42,60.96 v59.69,62.23
N$40  (via drill 0.55)
  Top 0.61: LED39.3 70.75,60.59 v71.12,60.96 | LED40.1 78.85,62.34 v78.74,62.23
  Bottom 0.61: v71.12,60.96 77.47,60.96 v78.74,62.23
N$41  (via drill 0.55)
  Top 0.61: LED40.3 89.8,60.59 v90.17,60.96 | LED41.1 97.9,62.34 v97.79,62.23
  Bottom 0.61: v90.17,60.96 96.52,60.96 v97.79,62.23
N$42  (via drill 0.55)
  Top 0.61: LED41.3 108.85,60.59 v109.22,60.96 | LED42.1 116.95,62.34 v116.84,62.23
  Bottom 0.61: v109.22,60.96 115.57,60.96 v116.84,62.23
N$43  (via drill 0.55)
  Top 0.61: LED42.3 127.9,60.59 v128.27,60.96 | LED43.1 136,62.34 v135.89,62.23
  Bottom 0.61: v128.27,60.96 134.62,60.96 v135.89,62.23
N$44  (via drill 0.55)
  Top 0.61: LED43.3 146.95,60.59 v147.32,60.96 | LED44.1 155.05,62.34 v154.94,62.23
  Bottom 0.61: v147.32,60.96 153.67,60.96 v154.94,62.23
N$45  (via drill 0.55)
  Top 0.61: LED44.3 166,60.59 v166.37,60.96 | LED45.1 174.1,62.34 v173.99,62.23
  Bottom 0.61: v166.37,60.96 172.72,60.96 v173.99,62.23
N$46  (via drill 0.55)
  Top 0.61: LED45.3 185.05,60.59 v185.42,60.96 | LED46.1 193.15,62.34 v193.04,62.23
  Bottom 0.61: v185.42,60.96 191.77,60.96 v193.04,62.23
N$47  (via drill 0.55)
  Top 0.61: LED46.3 202.83,60.59 v203.2,60.96 | LED47.1 212.2,62.34 v212.09,62.23
  Bottom 0.61: v203.2,60.96 210.82,60.96 v212.09,62.23
N$48  (via drill 0.55)
  Top 0.61: LED6.3 108.85,3.44 v109.22,3.81 | LED7.1 116.95,5.19 v116.84,5.08
  Bottom 0.61: v109.22,3.81 115.57,3.81 v116.84,5.08
VDD  (via drill 0.55)
  Top 0.61: v40.64,38.1 41.29,38.1 LED26.2 44.82,41.54 46.99,39.37 54.19,39.37 C27.1 63.3,41.06 LED27.2 63.87,41.54 66.04,39.37 73.24,39.37 C28.1 82.35,41.06 LED28.2 82.92,41.54 85.09,39.37 92.29,39.37 C29.1 101.4,41.06 LED29.2 101.97,41.54 104.14,39.37 107.95,39.37 109.64,41.06 C30.1 120.45,41.06 LED30.2 121.02,41.54 123.19,39.37 130.39,39.37 C31.1 139.5,41.06 LED31.2 140.07,41.54 142.24,39.37 149.44,39.37 C32.1 158.55,41.06 LED32.2 159.12,41.54 161.29,39.37 168.49,39.37 C33.1 177.6,41.06 LED33.2 178.17,41.54 180.34,39.37 187.54,39.37 C34.1 196.65,41.06 LED34.2 197.22,41.54 199.39,39.37 206.59,39.37 C35.1 v213.36,41.06 215.7,41.06 LED35.2 | LED48.2 215.7,22.01 v213.36,22.01 C23.1 204.89,22.01 203.2,20.32 199.39,20.32 197.22,22.49 LED23.2 196.65,22.01 C22.1 187.54,20.32 180.34,20.32 178.17,22.49 LED22.2 177.6,22.01 C21.1 168.49,20.32 161.29,20.32 159.12,22.49 LED21.2 158.55,22.01 C20.1 149.44,20.32 142.24,20.32 140.07,22.49 LED20.2 139.5,22.01 C19.1 130.39,20.32 123.19,20.32 121.02,22.49 LED19.2 120.45,22.01 C18.1 111.34,20.32 104.14,20.32 101.97,22.49 LED18.2 101.4,22.01 C17.1 92.29,20.32 85.09,20.32 82.92,22.49 LED17.2 82.35,22.01 C16.1 73.24,20.32 66.04,20.32 63.87,22.49 LED16.2 63.3,22.01 C15.1 54.19,20.32 46.99,20.32 44.82,22.49 LED15.2 44.25,22.01 C14.1 35.14,20.32 27.94,20.32 25.77,22.49 LED14.2 25.2,22.01 C13.1 14.39,22.01 12.7,20.32 8.89,20.32 6.72,22.49 LED13.2 4.18,22.49 | C26.1 31.33,38.1 v29.21,38.1 29.12,38.1 LED25.2 25.2,41.06 C25.1 16.09,39.37 8.89,39.37 6.72,41.54 LED24.2 4.18,41.54
  Top 0.61: LED12.2 215.7,2.96 v213.36,2.96 C11.1 206.59,1.27 199.39,1.27 197.22,3.44 LED11.2 196.65,2.96 C10.1 187.54,1.27 180.34,1.27 178.17,3.44 LED10.2 177.6,2.96 C9.1 168.49,1.27 161.29,1.27 159.12,3.44 LED9.2 158.55,2.96 C8.1 149.44,1.27 142.24,1.27 140.07,3.44 LED8.2 139.5,2.96 C7.1 130.39,1.27 123.19,1.27 121.02,3.44 LED7.2 120.45,2.96 C6.1 111.34,1.27 104.14,1.27 101.97,3.44 LED6.2 101.4,2.96 C5.1 92.29,1.27 85.09,1.27 82.92,3.44 LED5.2 82.35,2.96 C4.1 73.24,1.27 66.04,1.27 63.87,3.44 LED4.2 63.3,2.96 C3.1 54.19,1.27 46.99,1.27 44.82,3.44 LED3.2 44.25,2.96 C2.1 35.14,1.27 27.94,1.27 25.77,3.44 LED2.2 25.2,2.96 C1.1 16.09,1.27 8.89,1.27 6.72,3.44 LED1.2 4.18,3.44 2.54,5.08 2.54,20.83 4.18,22.46 4.18,22.49 | 4.18,41.54 2.54,43.18 2.54,58.42 4.71,60.59 LED36.2 6.72,60.59 8.89,58.42 12.7,58.42 14.39,60.11 C37.1 25.2,60.11 LED37.2 25.77,60.59 27.94,58.42 35.14,58.42 C38.1 44.25,60.11 LED38.2 44.82,60.59 46.99,58.42 54.19,58.42 C39.1 63.3,60.11 LED39.2 63.87,60.59 66.04,58.42 73.24,58.42 C40.1 82.35,60.11 LED40.2 82.92,60.59 85.09,58.42 92.29,58.42 C41.1 101.4,60.11 LED41.2 101.97,60.59 104.14,58.42 111.34,58.42 C42.1 120.45,60.11 LED42.2 122.29,60.59 124.46,58.42 130.39,58.42 C43.1 139.5,60.11 LED43.2 140.07,60.59 142.24,58.42 149.44,58.42 C44.1 158.55,60.11 LED44.2 159.12,60.59 161.29,58.42 168.49,58.42 C45.1 177.6,60.11 LED45.2 178.17,60.59 180.34,58.42 187.54,58.42 C46.1 196.65,60.11 LED46.2 197.22,60.59 199.39,58.42 203.2,58.42 204.89,60.11 C47.1 v213.36,60.11 215.7,60.11 LED47.2 | 4.18,22.49 2.54,24.13 2.54,39.88 4.18,41.52 4.18,41.54
  Top 0.61: C48.1 215.9,69.85 v213.36,67.31 | C36.1 215.9,50.8 v213.36,48.26 | C24.1 215.9,31.75 v213.36,29.21 | C12.1 215.9,12.7 v213.36,10.16
  Bottom 0.61: J1.5 39.14,38.12 | 39.14,38.12 39.12,38.1 | 39.14,38.12 40.62,38.12 v40.64,38.1 | 39.14,38.12 29.23,38.12 v29.21,38.1 | v213.36,67.31 v213.36,60.11 | v213.36,48.26 v213.36,41.06 | v213.36,29.21 v213.36,22.01 | v213.36,10.16 v213.36,2.96
(copper drawn outside any net)
  shapes: Top area x2

### Text on the board
bPlace: Louis Orleans